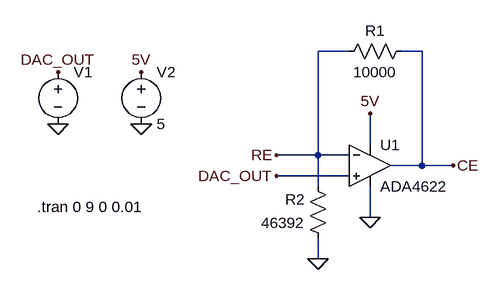
[diagram p0: schematic Control AMP ADA4625 Transient (Experimental).asc]
Control AMP ADA4625 Transient (Experimental).asc, the LTspice schematic file:
Version 4
SHEET 1 880 680
WIRE 176 -48 128 -48
WIRE 288 -48 256 -48
WIRE 208 96 208 48
WIRE 128 112 128 -48
WIRE 128 112 64 112
WIRE 176 112 128 112
WIRE 288 128 288 -48
WIRE 288 128 240 128
WIRE 336 128 288 128
WIRE 176 144 64 144
WIRE 128 160 128 112
WIRE 208 208 208 160
WIRE 128 272 128 240
FLAG 208 208 0
FLAG 208 48 5V
FLAG 336 128 CE
FLAG 64 144 DAC_OUT
FLAG 64 112 RE
FLAG 128 272 0
FLAG -144 64 0
FLAG -272 64 0
FLAG -272 -16 DAC_OUT
FLAG -144 -16 5V
SYMBOL OpAmps\\ADA4622 208 64 R0
SYMATTR InstName U1
SYMBOL res 272 -64 R90
WINDOW 0 0 56 VBottom 2
WINDOW 3 32 56 VTop 2
SYMATTR InstName R1
SYMATTR Value 10000
SYMBOL res 144 256 R180
WINDOW 0 36 76 Left 2
WINDOW 3 36 40 Left 2
SYMATTR InstName R2
SYMATTR Value 46392
SYMBOL voltage -272 -32 R0
WINDOW 123 0 0 Left 0
WINDOW 39 0 0 Left 0
WINDOW 3 24 96 Invisible 2
SYMATTR Value PWL file=swv.txt
SYMATTR InstName V1
SYMBOL voltage -144 -32 R0
WINDOW 123 0 0 Left 0
WINDOW 39 0 0 Left 0
SYMATTR InstName V2
SYMATTR Value 5
TEXT -304 192 Left 2 !.tran 0 9 0 0.01

The netlist it stands for:
* Control AMP ADA4625 Transient (Experimental).asc
XU1 DAC_OUT RE 5V 0 CE ADA4622  ; pins In+ In- V+ V- OUT
R1 CE RE 10000
R2 0 RE 46392
V1 DAC_OUT 0 PWL file=swv.txt
V2 5V 0 5
.tran 0 9 0 0.01
.lib ADA4622.lib
.backanno
.end

* Results of the author's LTspice run, read from the files saved beside the schematic
* Operating Point, zero values left out:
*   V(re) = 2.025 V
*   V(dac_out) = 2.025 V
*   V(5v) = 5 V
*   V(ce) = 2.461 V
*   I(R1) = 43.65 µA
*   I(R2) = -43.65 µA
*   I(V1) = -1.933 pA
*   I(V2) = -758.6 µA
*   Ix(u1:1) = 1.91 pA
*   Ix(u1:2) = -2.043 pA
*   Ix(u1:3) = 758.6 µA
*   Ix(u1:4) = -758.6 µA
*   Ix(u1:5) = -43.65 µA
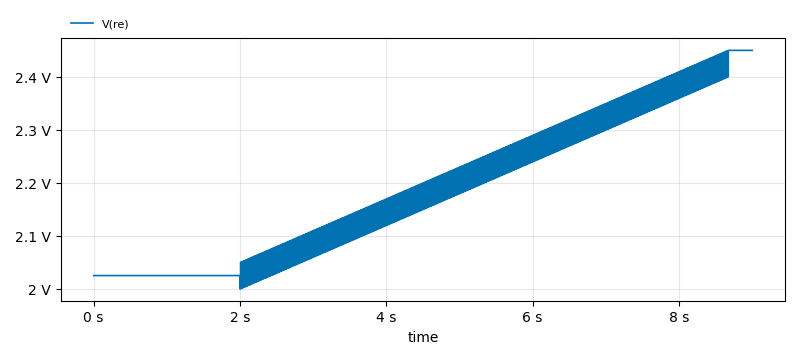
[diagram p1: Transient Analysis of Control AMP ADA4625 Transient (Experimental).asc, plotted from the saved traces]
* Transient Analysis, 1 run:
*   V(re): min 2 V, max 2.45 V, average 2.188 V, rms 2.193 V, last 2.45 V